# EAGLE schematic project github (EAGLE 9.6.1)
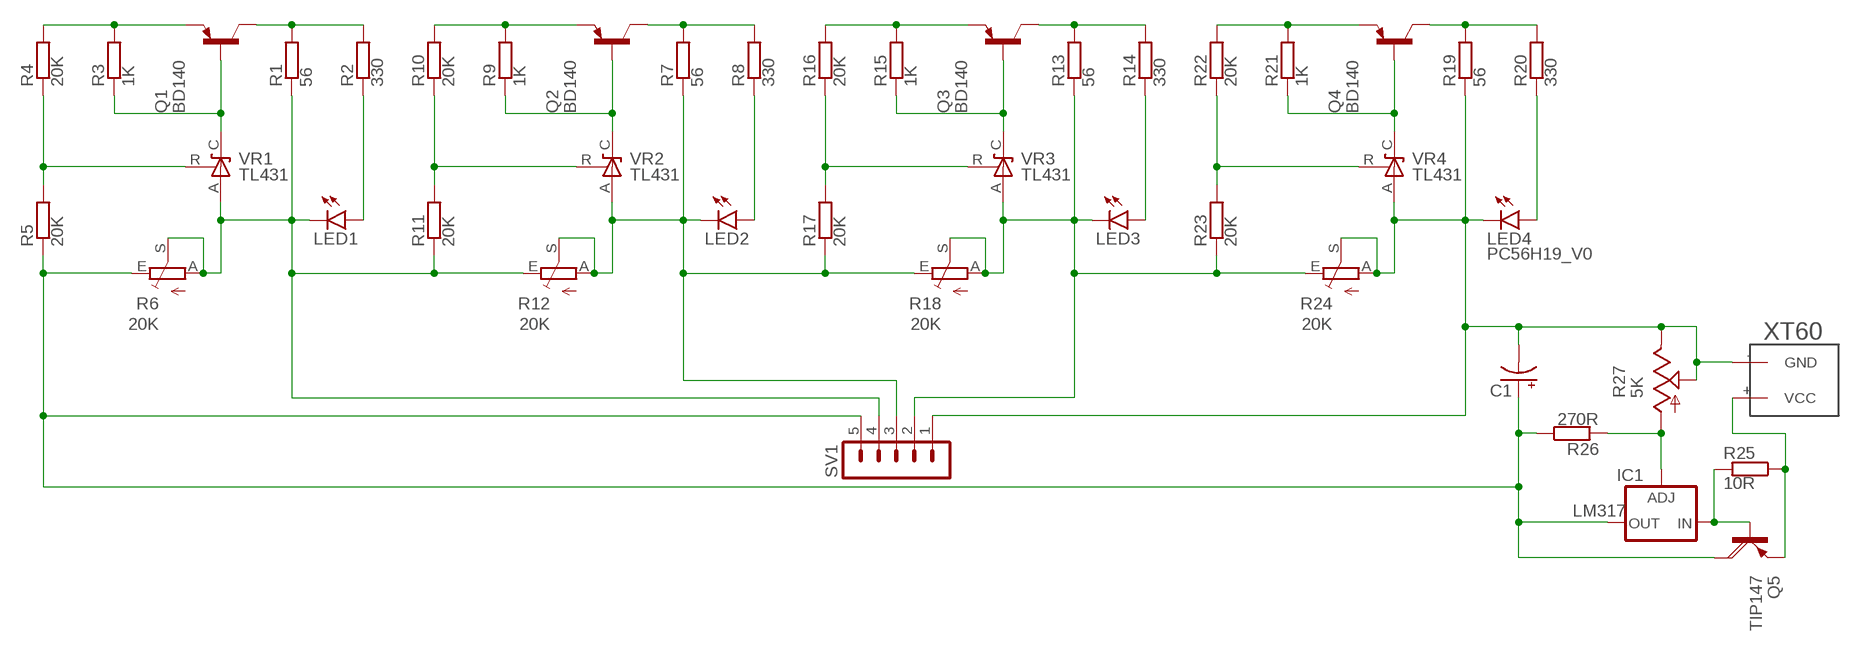
[diagram p0: schematic, sheet 1]

## Parts
C1  CPOL-US153CLV-0810  [153CLV-0810]
IC1  LM317  LM317MABDT  [DPACK]
LED1  PC56H19_V0  [PC56H19_V0]
LED2  PC56H19_V0  [PC56H19_V0]
LED3  PC56H19_V0  [PC56H19_V0]
LED4  PC56H19_V0  [PC56H19_V0]
Q1  BD140  [TO126]
Q2  BD140  [TO126]
Q3  BD140  [TO126]
Q4  BD140  [TO126]
Q5  TIP147  [SOT93]
R1  56  SMK  [SMK]
R2  330  SMK  [SMK]
R3  1K  SMK  [SMK]
R4  20K  SMK  [SMK]
R5  20K  SMK  [SMK]
R6  20K  TRIM_EU-RJ9W  [RJ9W]
R7  56  SMK  [SMK]
R8  330  SMK  [SMK]
R9  1K  SMK  [SMK]
R10  20K  SMK  [SMK]
R11  20K  SMK  [SMK]
R12  20K  TRIM_EU-RJ9W  [RJ9W]
R13  56  SMK  [SMK]
R14  330  SMK  [SMK]
R15  1K  SMK  [SMK]
R16  20K  SMK  [SMK]
R17  20K  SMK  [SMK]
R18  20K  TRIM_EU-RJ9W  [RJ9W]
R19  56  SMK  [SMK]
R20  330  SMK  [SMK]
R21  1K  SMK  [SMK]
R22  20K  SMK  [SMK]
R23  20K  SMK  [SMK]
R24  20K  TRIM_EU-RJ9W  [RJ9W]
R25  10R  SMK  [SMK]
R26  270R  SMK  [SMK]
R27  5K  TRIM_US-RJ9W  [RJ9W]
SV1  MA05-1  [MA05-1]
U$1  XT60  [XT60]
VR1  TL431  [TO-92_RAC]
VR2  TL431  [TO-92_RAC]
VR3  TL431  [TO-92_RAC]
VR4  TL431  [TO-92_RAC]

## Nets
N$1: Q1.1(E) R3.1 R4.1
N$2: R4.2 R5.1 VR1.R
N$3: Q1.3(B) R3.2 VR1.C
N$4: Q1.2(C) R1.1 R2.1
N$5: LED1.1(C) LED1.3(C) R1.2 R6.A R6.S R11.2 R12.E SV1.4 VR1.A
N$6: R10.2 R11.1 VR2.R
N$7: C1.+ IC1.4(OUT) Q5.C R5.2 R6.E R26.1 SV1.5
N$8: C1.- LED4.1(C) LED4.3(C) R19.2 R24.A R24.S R27.E R27.S SV1.1 U$1.-(GND) VR4.A
N$9: Q2.3(B) R9.2 VR2.C
N$10: Q2.1(E) R9.1 R10.1
N$11: Q2.2(C) R7.1 R8.1
N$12: LED2.1(C) LED2.3(C) R7.2 R12.A R12.S R17.2 R18.E SV1.3 VR2.A
N$13: IC1.1(ADJ) R26.2 R27.A
N$15: R16.2 R17.1 VR3.R
N$16: Q3.3(B) R15.2 VR3.C
N$17: Q3.1(E) R15.1 R16.1
N$18: Q3.2(C) R13.1 R14.1
N$19: LED3.1(C) LED3.3(C) R13.2 R18.A R18.S R23.2 R24.E SV1.2 VR3.A
N$20: IC1.3(IN) Q5.B R25.2
N$21: LED3.2(A) LED3.4(A) R14.2
N$22: R22.2 R23.1 VR4.R
N$23: Q4.3(B) R21.2 VR4.C
N$24: Q4.1(E) R21.1 R22.1
N$25: Q4.2(C) R19.1 R20.1
N$27: Q5.E R25.1 U$1.+(VCC)
N$28: LED4.2(A) LED4.4(A) R20.2
N$29: LED1.2(A) LED1.4(A) R2.2
N$30: LED2.2(A) LED2.4(A) R8.2

## Library data of the parts
C1 = rcl:CPOL-US: POLARIZED CAPACITOR, American symbol; SPICEPREFIX: C
IC1 = v-reg:LM317?*: 500 mA Adjustable Output Positive Voltage Regulator Source: http://www.onsemi.co.jp .. LM317M-D.PDF
LED1-LED4 = led:PC56H19_V0: Lextar white SMD LED Source: PC56H19_20150317.pdf www.lextar.com
Q1-Q4 = transistor-pnp:BD140: PNP Transistor
Q5 = transistor-power:TIP147: PNP DARLINGTON TRANSISTOR
R1-R5 R7-R11 R13-R17 R19-R23 R25 R26 = resistor-shunt:SMK: SMD SHUNT RESISTOR; OC_FARNELL: unknown; OC_NEWARK: unknown
R6 R12 R18 R24 = pot:TRIM_EU-: POTENTIOMETER
R27 = pot:TRIM_US-: POTENTIOMETER
SV1 = con-lstb:MA05-1: PIN HEADER; OC_FARNELL: unknown; OC_NEWARK: unknown
U$1 = XT60:XT60: XT60
VR1-VR4 = voltage regulators:TL431: Voltage regulator